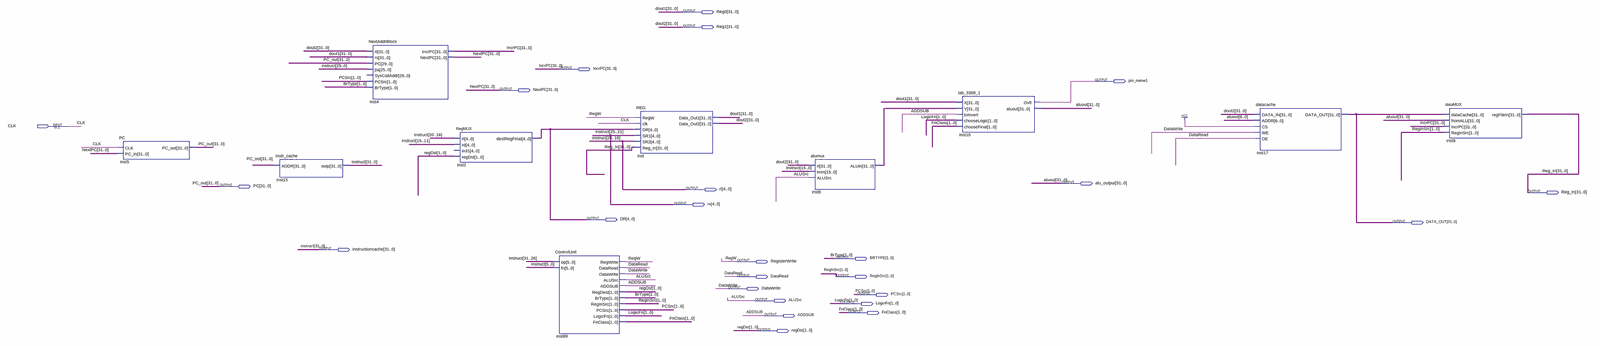
[diagram p0: schematic sheet, whole]
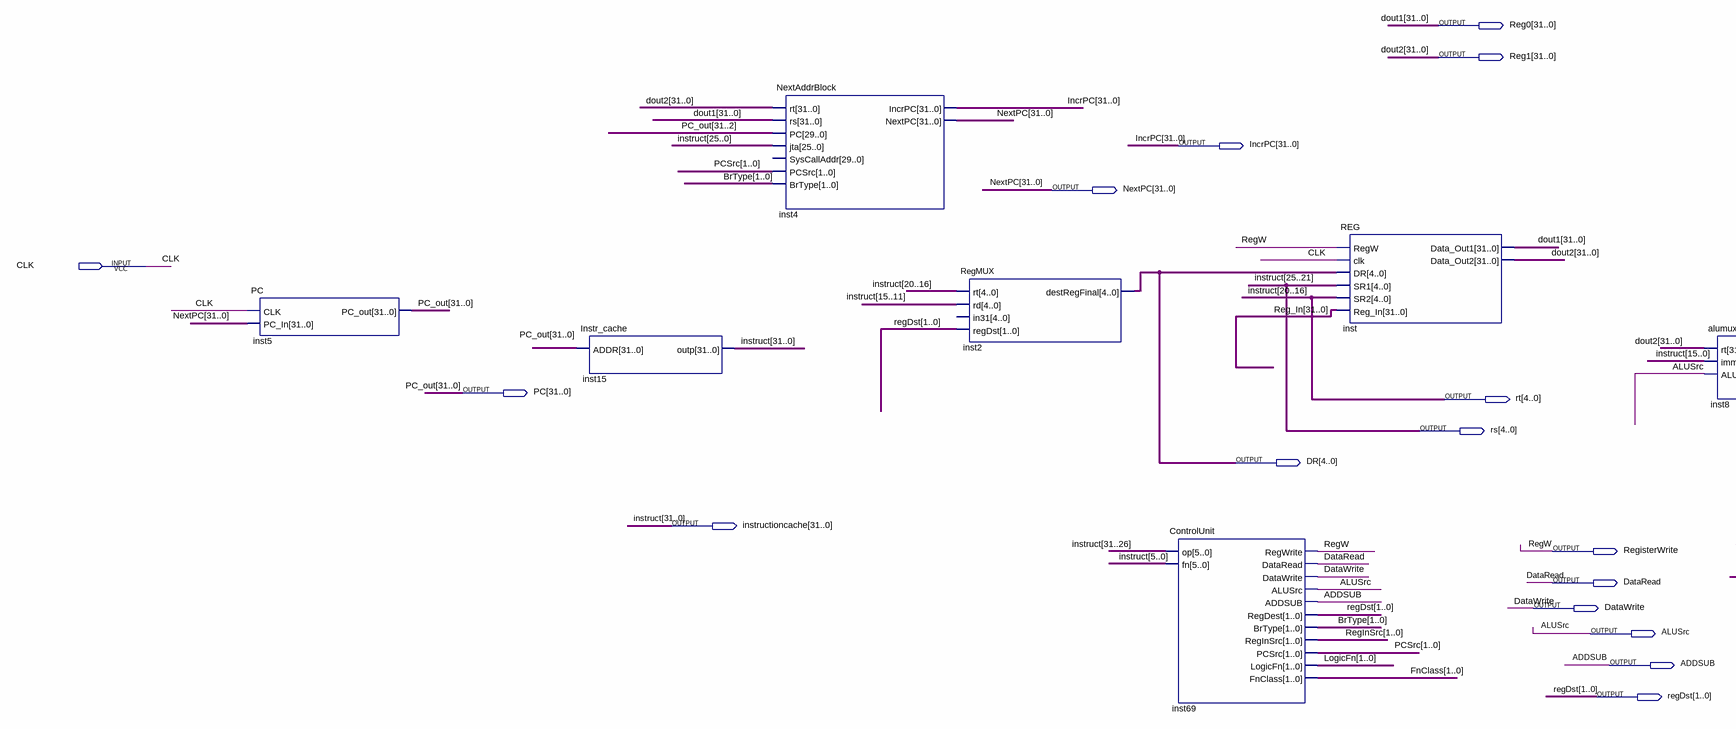
[diagram p1: schematic sheet, left part]
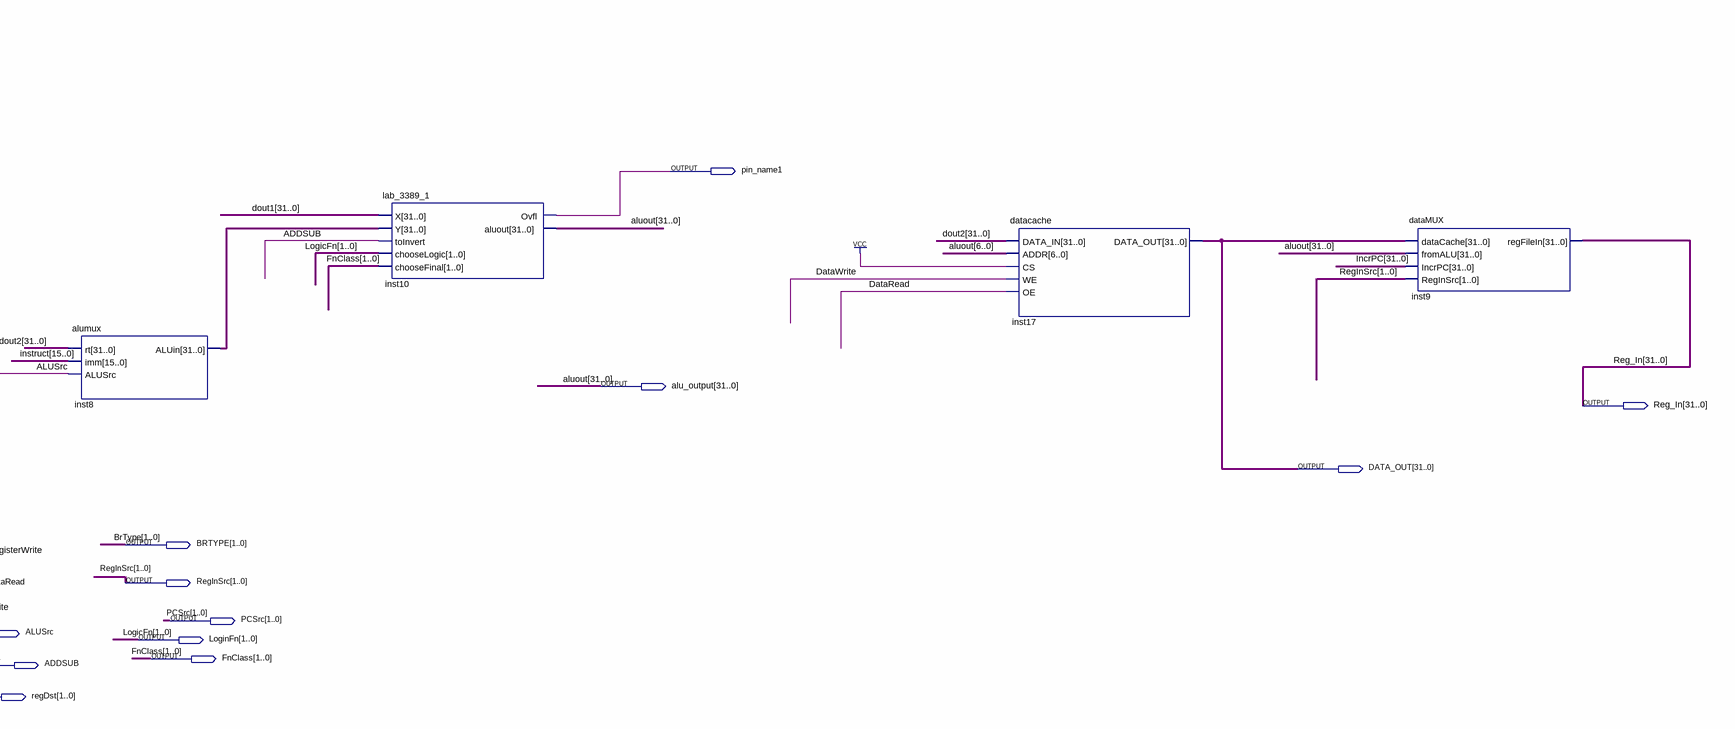
[diagram p2: schematic sheet, right part]
// Quartus schematic lab3Final.bdf as structural Verilog: 10 symbols, 25 pins
module lab3Final (
  input  CLK,
  output [31:0] Reg0,
  output [31:0] Reg1,
  output [31:0] IncrPC,
  output pin_name1,
  output [31:0] NextPC,
  output [31:0] alu_output,
  output [31:0] PC,
  output [4:0] rt,
  output [31:0] Reg_In,
  output [4:0] rs,
  output [4:0] DR,
  output [31:0] DATA_OUT,
  output [31:0] instructioncache,
  output [1:0] BRTYPE,
  output RegisterWrite,
  output DataRead,
  output [1:0] RegInSrc,
  output DataWrite,
  output [1:0] PCSrc,
  output ALUSrc,
  output [1:0] LoginFn,
  output [1:0] FnClass,
  output ADDSUB,
  output [1:0] regDst
);

  wire [31:0] inst8_aluin;

  PC inst5 (.CLK(CLK), .PC_In(NextPC), .PC_out(PC));
  Instr_cache inst15 (.ADDR(PC), .outp(instructioncache));
  NextAddrBlock inst4 (
    .rt(Reg1), .rs(Reg0), .PC(PC[31:2]), .jta(instructioncache[25:0]), .PCSrc(PCSrc), .BrType(BRTYPE),
    .IncrPC(IncrPC), .NextPC(NextPC));  // open: SysCallAddr
  RegMUX inst2 (
    .rt(instructioncache[20:16]), .rd(instructioncache[15:11]), .regDst(regDst), .destRegFinal(DR));  // open: in31
  ControlUnit inst69 (
    .op(instructioncache[31:26]), .fn(instructioncache[5:0]), .RegWrite(RegisterWrite), .DataRead(DataRead),
    .DataWrite(DataWrite), .ALUSrc(ALUSrc), .ADDSUB(ADDSUB), .RegDest(regDst), .BrType(BRTYPE),
    .RegInSrc(RegInSrc), .PCSrc(PCSrc), .LogicFn(LoginFn), .FnClass(FnClass));
  REG inst (
    .RegW(RegisterWrite), .clk(CLK), .DR(DR), .SR1(instructioncache[25:21]), .SR2(instructioncache[20:16]),
    .Reg_In(Reg_In), .Data_Out1(Reg0), .Data_Out2(Reg1));
  alumux inst8 (.rt(Reg1), .imm(instructioncache[15:0]), .ALUSrc(ALUSrc), .ALUin(inst8_aluin));
  lab_3389_1 inst10 (
    .X(Reg0), .Y(inst8_aluin), .toInvert(ADDSUB), .chooseLogic(LoginFn), .chooseFinal(FnClass),
    .Ovfl(pin_name1), .aluout(alu_output));
  datacache inst17 (
    .DATA_IN(Reg1), .ADDR(alu_output[6:0]), .CS(1'b1), .WE(DataWrite), .OE(DataRead), .DATA_OUT(DATA_OUT));
  dataMUX inst9 (.dataCache(DATA_OUT), .fromALU(alu_output), .IncrPC(IncrPC), .RegInSrc(RegInSrc), .regFileIn(Reg_In));

  assign rs = instructioncache[25:21];
  assign rt = instructioncache[20:16];

  // Other names for the same wires on the sheet: aluout[31:0] = alu_output; dout1[31:0] = Reg0; dout2[31:0] = Reg1;
  //   instruct[31:0] = instructioncache; LogicFn[1:0] = LoginFn; PC_out[31:0] = PC; RegW = RegisterWrite
endmodule
